# EAGLE design hs-32-spi-3d (EAGLE 9.6.2)
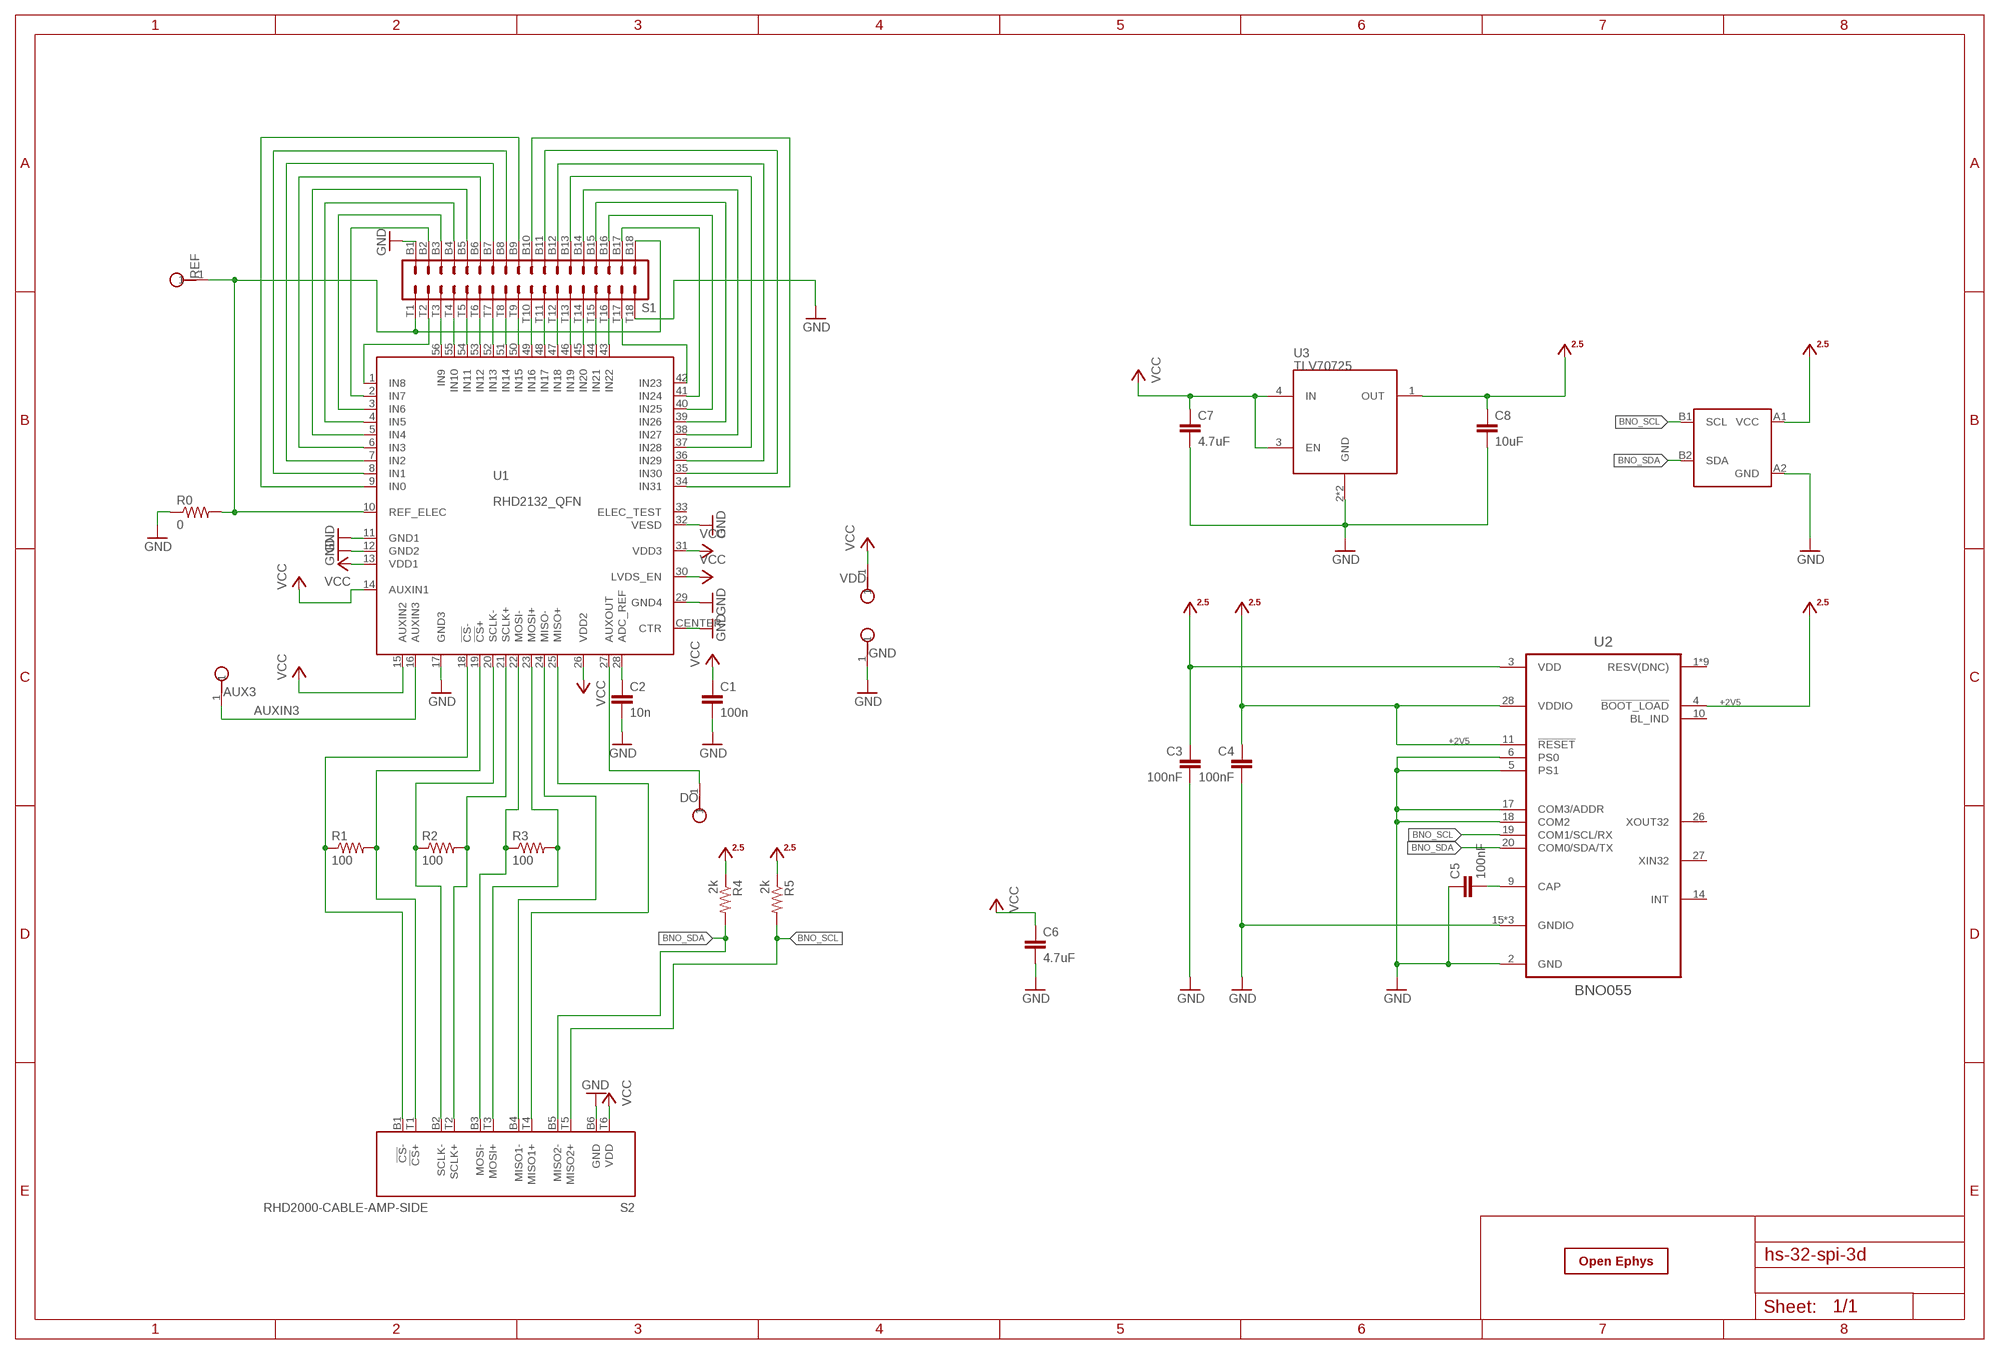
[diagram p0: schematic, sheet 1]

## Parts
AUX3  TESTPOINT_SMALL  [TESTPOINT_SMALL]
C1  100n  C_0402  [0402]
C2  10n  C_0402  [0402]
C3  100nF  C_0402T  [0402T]
C4  100nF  C_0402T  [0402T]
C5  100nF  C_0201T  [0201T]
C6  4.7uF  C_0402  [0402]
C7  4.7uF  C_0402T  [0402T]
C8  10uF  C_0402T  [0402T]
DO  TESTPOINT_SMALL  [TESTPOINT_SMALL]
GND  TESTPOINT_SMALL  [TESTPOINT_SMALL]
R0  0  R_0402  [0402]
R1  100  R_0402  [0402]
R2  100  R_0402  [0402]
R3  100  R_0402  [0402]
R4  2k  R_0201T  [0201T]
R5  2k  R_0201T  [0201T]
REF  TESTPOINT_SMALL  [TESTPOINT_SMALL]
S1  OMNETICS_A79025  [OMNETICS_A79025]
S2  RHD2000-CABLE-AMP-SIDE  [OMNETICS_PZN-12-AA]
U1  RHD2132_QFN  [QFN56_8_X_8_LARGE]
U2  BNO055  [LGA-28-3.8X5.2]
U3  TLV70725  TLV707  [X2SON]
U4  24CW640T-I/CS0668  [4-BALL_WAFFER_0.4MMX0.4MM]
VDD  TESTPOINT_SMALL  [TESTPOINT_SMALL]
X  OE-LOGO_3.5X2.5  [OE-LOGO-3.5X2.5]

## Nets
+2V5: C3.1 C4.1 C8.1 R4.1 R5.1 U2.3(VDD) U2.4(!BOOT_LOAD) U2.11(!RESET) U2.28(VDDIO) U3.1(OUT) U4.A1(VCC)
AUXIN3: AUX3.1 U1.16(AUXIN3)
BNO_SCL: R5.2 S2.T5(MISO2+) U2.19(COM1/SCL/RX) U4.B1(SCL)
BNO_SDA: R4.2 S2.B5(MISO2-) U2.20(COM0/SDA/TX) U4.B2(SDA)
GND: C1.2 C2.2 C3.2 C4.2 C5.1 C6.2 C7.2 C8.2 GND.1 R0.1 S1.B1 S1.T18 S2.B6(GND) U1.11(GND1) U1.12(GND2) U1.17(GND3) U1.29(GND4) U1.32(VESD) U1.CENTER(CTR) U2.2(GND) U2.5(PS1) U2.6(PS0) U2.15(GNDIO) U2.16(GNDIO) U2.17(COM3/ADDR) U2.18(COM2) U2.25(GNDIO) U3.2(GND) U3.PAD(GND) U4.A2(GND)
N$1: R0.2 REF.1 S1.B18 S1.T1 U1.10(REF_ELEC)
N$2: S1.B3 U1.3(IN6)
N$3: S1.B2 U1.2(IN7)
N$4: S1.B4 U1.4(IN5)
N$5: S1.B5 U1.5(IN4)
N$6: S1.B6 U1.6(IN3)
N$7: S1.B7 U1.7(IN2)
N$8: S1.B8 U1.8(IN1)
N$9: S1.B9 U1.9(IN0)
N$10: S1.B10 U1.34(IN31)
N$11: R1.1 S2.B1(!CS!-) U1.18(!CS!-)
N$12: S1.B17 U1.41(IN24)
N$13: S1.B16 U1.40(IN25)
N$14: S1.B15 U1.39(IN26)
N$15: S1.B14 U1.38(IN27)
N$16: S1.B13 U1.37(IN28)
N$17: S1.B12 U1.36(IN29)
N$18: S1.B11 U1.35(IN30)
N$19: S1.T9 U1.50(IN15)
N$20: S1.T8 U1.51(IN14)
N$21: S1.T7 U1.52(IN13)
N$22: S1.T3 U1.56(IN9)
N$23: S1.T4 U1.55(IN10)
N$24: S1.T5 U1.54(IN11)
N$25: S1.T6 U1.53(IN12)
N$26: S1.T10 U1.49(IN16)
N$27: S1.T11 U1.48(IN17)
N$28: S1.T12 U1.47(IN18)
N$29: S1.T13 U1.46(IN19)
N$30: S1.T14 U1.45(IN20)
N$31: S1.T15 U1.44(IN21)
N$32: S1.T16 U1.43(IN22)
N$33: S1.T2 U1.1(IN8)
N$34: S1.T17 U1.42(IN23)
N$35: R1.2 S2.T1(!CS!+) U1.19(!CS!+)
N$36: R2.1 S2.B2(SCLK-) U1.20(SCLK-)
N$37: R2.2 S2.T2(SCLK+) U1.21(SCLK+)
N$38: R3.1 S2.B3(MOSI-) U1.22(MOSI-)
N$39: R3.2 S2.T3(MOSI+) U1.23(MOSI+)
N$40: S2.B4(MISO1-) U1.24(MISO-)
N$41: S2.T4(MISO1+) U1.25(MISO+)
N$42: C2.1 U1.28(ADC_REF)
N$43: DO.1 U1.27(AUXOUT)
N$67: C5.2 U2.9(CAP)
VCC: C1.1 C6.1 C7.1 S2.T6(VDD) U1.13(VDD1) U1.14(AUXIN1) U1.15(AUXIN2) U1.26(VDD2) U1.30(LVDS_EN) U1.31(VDD3) U3.3(EN) U3.4(IN) VDD.1
Unconnected: U1.33(ELEC_TEST) U2.1(RESV(DNC)) U2.7(RESV(DNC)) U2.8(RESV(DNC)) U2.10(BL_IND) U2.12(RESV(DNC)) U2.13(RESV(DNC)) U2.14(INT) U2.21(RESV(DNC)) U2.22(RESV(DNC)) U2.23(RESV(DNC)) U2.24(RESV(DNC)) U2.26(XOUT32) U2.27(XIN32)

## Library data of the parts
AUX3 DO GND REF VDD = RHD2000_eval_board:TESTPOINT: PCB Test Point
C1 C2 = RHD2000_eval_board:C: Capacitor
C3-C6 = jonnew:C: Capacitor
C7 = jonnew:C: Capacitor; PARTNO: CL05A105KO5NNNC
C8 = jonnew:C: Capacitor; PARTNO: CL05A106MQ5NUNC
R0 R1-R3 = RHD2000_eval_board:R: Resistor
R4 R5 = jonnew:R: Resistor
S1 = RHD2000:OMNETICS_A79025
S2 = RHD2000:RHD2000-CABLE-AMP-SIDE
U1 = RHD2000:RHD2132
U2 = jonnew:BNO055
U3 = jonnew:TLV707
U4 = 24CW640T-I_CS0668:24CW640T-I/CS0668
X = jonnew:OE-LOGO

## Net classes
1 thick: width 1.016 mm
2 power: width 0.61 mm

## Board
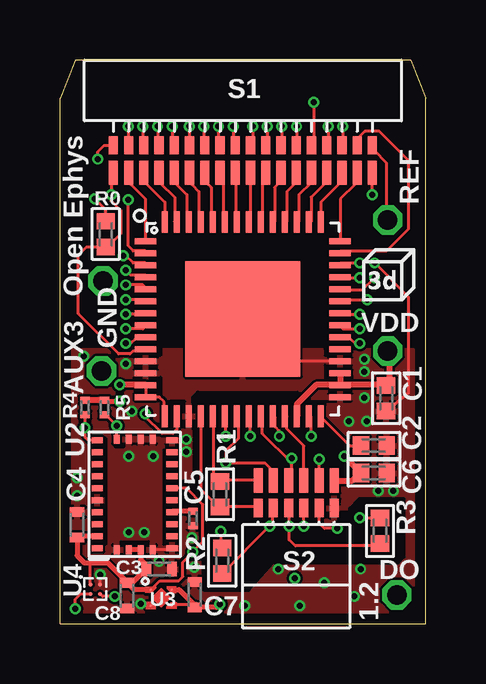
[diagram p1: board, top side]
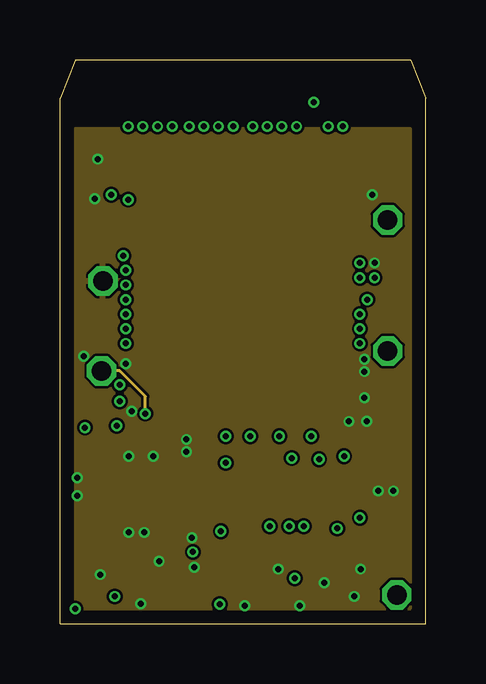
[diagram p2: board, inner layer Route2]
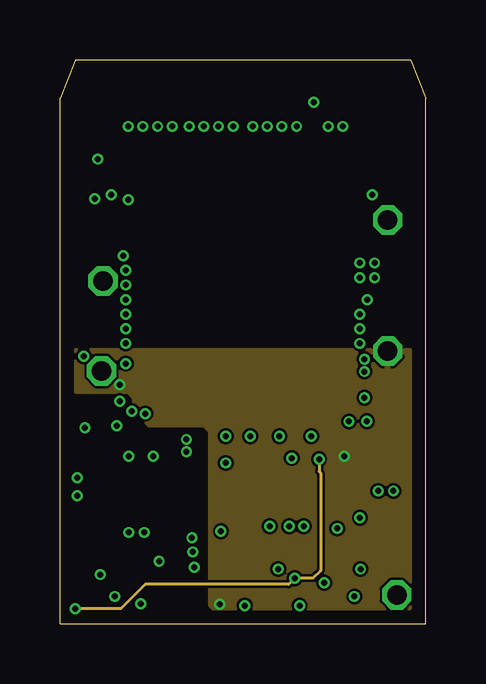
[diagram p3: board, inner layer Route3]
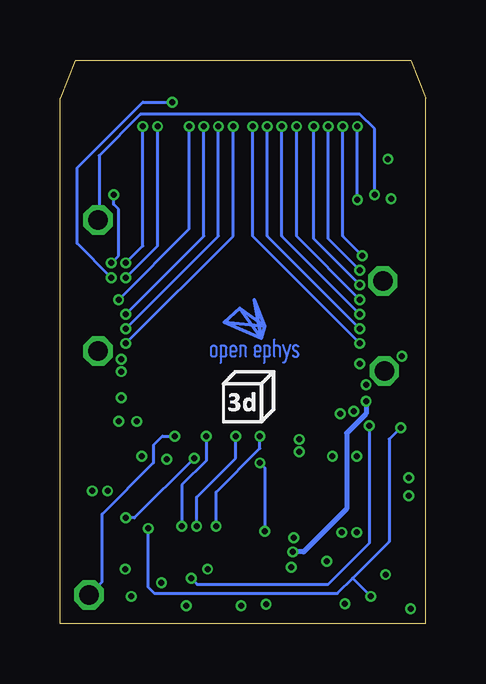
[diagram p4: board, bottom side, seen from below]

Size 15.24 x 23.5 mm. Coordinates in mm from the lower left corner, seen from the top.
Outline: 0,0 0,21.91 0.64,23.5 14.61,23.5 15.24,21.91 15.24,0 0,0
Copper layers (1*2+3*16): Top 0.035mm / dielectric 0.2mm / Route2 0.0175mm / dielectric 0.3mm / Route3 0.035mm / dielectric 0.2mm / Bottom 0.035mm
Design rules "seeed-studio-4-layer *": minimum track width 0.09mm, minimum drill 0.2mm, track to track 4mil, track to pad 4mil, pad to pad 4mil, via to via 4mil, smd to smd 0mil, copper to edge 0.1mm, drill to drill 10mil, minimum pad ring 6mil, minimum via ring 4mil, stop-mask expansion 1mil, vias tented up to drill 100mil, thermal gap 0.1mm
tRestrict: 26 lines

### Footprints (pad centres in the part's own frame; a part is rotated, then mirrored left to right if it is on the bottom)
TESTPOINT_SMALL = drill 0.813 octagon: 1 0,0
0402 = smd 0.686 x 0.762: 1 -0.533,0; 2 0.533,0
0402T = smd 0.4 x 0.6: 1 -0.533,0; 2 0.533,0
0201T = smd 0.3 x 0.4: 1 -0.3,0; 2 0.3,0
OMNETICS_A79025 = smd 0.381 x 0.762: B1 -5.397,-1.016; B2 -4.763,-1.016; B3 -4.128,-1.016; B4 -3.493,-1.016; B5 -2.857,-1.016; B6 -2.223,-1.016; B7 -1.587,-1.016; B8 -0.953,-1.016; B9 -0.318,-1.016; B10 0.318,-1.016; B11 0.953,-1.016; B12 1.587,-1.016; B13 2.223,-1.016; B14 2.857,-1.016; B15 3.493,-1.016; B16 4.128,-1.016; B17 4.763,-1.016; B18 5.397,-1.016 | smd 0.381 x 1.016: T1 -5.397,-2.159; T2 -4.763,-2.159; T3 -4.128,-2.159; T4 -3.493,-2.159; T5 -2.857,-2.159; T6 -2.223,-2.159; T7 -1.587,-2.159; T8 -0.953,-2.159; T9 -0.318,-2.159; T10 0.318,-2.159; T11 0.953,-2.159; T12 1.587,-2.159; T13 2.223,-2.159; T14 2.857,-2.159; T15 3.493,-2.159; T16 4.128,-2.159; T17 4.763,-2.159; T18 5.397,-2.159
OMNETICS_PZN-12-AA = smd 0.381 x 0.762: B1 1.587,-1.016; B2 0.953,-1.016; B3 0.318,-1.016; B4 -0.318,-1.016; B5 -0.953,-1.016; B6 -1.587,-1.016 | smd 0.381 x 1.016: T1 1.587,-2.159; T2 0.953,-2.159; T3 0.318,-2.159; T4 -0.318,-2.159; T5 -0.953,-2.159; T6 -1.587,-2.159
QFN56_8_X_8_LARGE = smd 0.9 x 0.25: 1 -4.05,3.25; 2 -4.05,2.75; 3 -4.05,2.25; 4 -4.05,1.75; 5 -4.05,1.25; 6 -4.05,0.75; 7 -4.05,0.25; 8 -4.05,-0.25; 9 -4.05,-0.75; 10 -4.05,-1.25; 11 -4.05,-1.75; 12 -4.05,-2.25; 13 -4.05,-2.75; 14 -4.05,-3.25; 29 4.05,-3.25; 30 4.05,-2.75; 31 4.05,-2.25; 32 4.05,-1.75; 33 4.05,-1.25; 34 4.05,-0.75; 35 4.05,-0.25; 36 4.05,0.25; 37 4.05,0.75; 38 4.05,1.25; 39 4.05,1.75; 40 4.05,2.25; 41 4.05,2.75; 42 4.05,3.25 | smd 0.25 x 0.9: 15 -3.25,-4.05; 16 -2.75,-4.05; 17 -2.25,-4.05; 18 -1.75,-4.05; 19 -1.25,-4.05; 20 -0.75,-4.05; 21 -0.25,-4.05; 22 0.25,-4.05; 23 0.75,-4.05; 24 1.25,-4.05; 25 1.75,-4.05; 26 2.25,-4.05; 27 2.75,-4.05; 28 3.25,-4.05; 43 3.25,4.05; 44 2.75,4.05; 45 2.25,4.05; 46 1.75,4.05; 47 1.25,4.05; 48 0.75,4.05; 49 0.25,4.05; 50 -0.25,4.05; 51 -0.75,4.05; 52 -1.25,4.05; 53 -1.75,4.05; 54 -2.25,4.05; 55 -2.75,4.05; 56 -3.25,4.05 | smd 4.8 x 4.8: CENTER 0,0
LGA-28-3.8X5.2 = smd 0.25 x 0.475: 1 -2.25,1.56; 6 -2.25,-1.56; 7 -1.75,-1.56; 8 -1.25,-1.56; 9 -0.75,-1.56; 10 -0.25,-1.56; 11 0.25,-1.56; 12 0.75,-1.56; 13 1.25,-1.56; 14 1.75,-1.56; 15 2.25,-1.56; 20 2.25,1.56; 21 1.75,1.56; 22 1.25,1.56; 23 0.75,1.56; 24 0.25,1.56; 25 -0.25,1.56; 26 -0.75,1.56; 27 -1.25,1.56; 28 -1.75,1.56 | smd 0.375 x 0.25: 2 -2.3,0.75; 3 -2.3,0.25; 4 -2.3,-0.25; 5 -2.3,-0.75; 16 2.3,-0.75; 17 2.3,-0.25; 18 2.3,0.25; 19 2.3,0.75
X2SON = smd 0.1 x 0.1: 1 -0.43,0.33; 2 -0.43,-0.33; 3 0.43,-0.33; 4 0.43,0.33 | smd 0.1 x 0.1 rotated 45: PAD 0,0
4-BALL_WAFFER_0.4MMX0.4MM = smd 0.163 x 0.163: A1 0,0; A2 0.4,0; B1 0,-0.4; B2 0.4,-0.4

### Placement (x,y rotation side)
AUX3  1.73,10.54 0 top
C1  13.59,9.4 270 top
C2  13.08,7.43 0 top
C3  4.13,2.29 0 top
C4  0.71,4.13 90 top
C5  5.54,4.39 90 top
C6  13.08,6.29 0 top
C7  5.61,1.22 90 top
C8  2.79,1.18 270 top
DO  14.03,1.21 0 top
GND  1.79,14.29 0 top
R0  1.91,16.24 270 top
R1  6.67,5.4 90 top
R2  6.76,2.63 90 top
R3  13.34,3.87 90 top
R4  1.04,9.02 270 top
R5  1.85,9.02 270 top
REF  13.65,16.83 90 top
S1  7.62,20.95 0 top
S2  9.84,3.81 180 top
U1  7.62,12.7 0 top
U2  3.11,5.4 90 top
U3  4.22,1.09 0 top
U4  1.27,1.65 0 top
VDD  13.65,11.37 0 top
X  7.3,11.81 0 bottom

### Tracks (layer width: path | path; a pad name or v marks a point on that pad's centre or on a via)
+2V5  (via drill 0.25)
  Top 0.127: U3.1 4.16,1.8 4.94,1.8 5.12,1.97 5.12,2.58 v5.54,3 5.95,3.41 5.95,4.97 5.28,5.65 U2.11 | R5.1 1.9,9.27 | U4.A1 1.27,2.54
  Top 0.203: U3.1 3.09,1.42 C8.1 | C8.1 3.01,1.71 C3.1 3.59,2.44 3.36,2.67 U2.4 U2.3 | C8.1 2.79,1.74 1.99,2.54 1.27,2.54 1.02,2.54 0.71,2.85 C4.1 0.77,3.65 U2.28 | 1.9,9.27 v2.49,9.27
  Top 0.254: R5.1 R4.1
  Bottom 0.203: v2.49,9.27 2.49,8.76 3.3,7.95 3.3,4.79 5.09,3 v5.54,3
AUXIN3  (via drill 0.25)
  Top 0.127: U1.16 4.87,8.11 4.7,7.94 4.25,7.94 3.56,8.64 v3.56,8.76
  Route2 0.127: v3.56,8.76 3.56,9.47 2.49,10.54 AUX3.1
BNO_SCL  (via drill 0.25)
  Top 0.127: U2.19 v2.36,8.26 | R5.2 1.91,8.72 v2.36,8.26 | v2.36,8.26 | S2.T5 v10.79,6.86 | v0.64,0.64 0.64,1.02 0.87,1.25 U4.B1
  Route3 0.127: v10.79,6.86 10.79,6.35 10.86,6.29 10.86,2.22 10.54,1.91 v9.78,1.91 9.53,1.65 3.56,1.65 2.54,0.64 v0.64,0.64
  Bottom 0.127: v2.36,8.26 2.36,3.35 4.06,1.65 9.53,1.65 v9.78,1.91
BNO_SDA  (via drill 0.25)
  Top 0.127: U2.20 1.2,7.65 1.04,7.8 v1.04,8.18 R4.2 | v11.56,3.98 11.01,3.98 10.79,4.19 S2.B5 | v2.29,1.14 1.78,1.14 U4.B2
  Bottom 0.127: v1.04,8.18 1.52,7.7 1.52,3.43 3.05,1.91 | 3.05,1.91 3.68,1.27 11.3,1.27 11.56,1.52 v11.56,3.98 | 3.05,1.91 v2.29,1.14
GND  (via drill 0.25)
  Top 0.127: U1.CENTER 9.35,10.97 11.58,10.97 U1.32 | v13.01,17.88 13.01,18.8 S1.T18 | v13.11,15.04 14.53,13.61 14.53,9.65 C1.2 | U2.6 4.62,3.1 U2.5 | v1.57,19.37 1.57,19.67 1.84,19.94 S1.B1 | R0.1 1.91,17.26 v1.45,17.72 | U4.A2 v1.67,2.05 v1.68,2.06
  Bottom 0.127: v13.01,17.88 13.01,17.48 12.8,17.27 12.8,15.34 v13.11,15.04
  other vias: 12.79,8.45 13.89,5.54 5.27,7.18 13.26,5.54 12.04,8.43 12.69,9.42 12.69,10.52 2.74,10.85 0.99,11.15 3.51,3.81 5.6,2.36 2.87,3.81 0.71,5.33 0.71,6.1 3.89,6.99 2.87,6.99 5.5,3.58 9.09,2.29 12.52,2.29 11.01,1.71 12.27,1.14 9.98,0.76 7.7,0.76 4.13,2.62 3.37,0.84 12.69,11.02 5.27,7.68 3,8.86
  pour Route2: 0.64,0.64 14.61,0.64 14.61,20.64 0.64,20.64
  pour Top: 0.76,0.51 14.73,0.51 14.73,11.43 0.51,11.43 0.51,0.51
N$1  (via drill 0.25)
  Top 0.127: S1.B18 13.11,19.91 13.11,19.71 13.61,19.2 13.61,16.87 REF.1 | S1.T1 2.13,18.8 v2.13,17.88 2.13,17.63 2.54,17.22 2.54,16.26 1.99,15.71 R0.2 1.78,15.71 1.65,15.71 1.1,15.71 0.76,15.37 0.76,12.93 2.44,11.25 2.92,11.25 3.05,11.38 3.56,11.38 U1.10
  Bottom 0.127: v2.13,17.88 2.13,20.62 2.74,21.23 11.89,21.23 13.61,19.51 13.61,16.87 REF.1
N$2  (via drill 0.25)
  Top 0.127: v3.45,20.73 3.45,20.02 S1.B3 | v2.64,15.34 2.74,15.34 3.05,15.04 3.56,15.04 U1.3
  Bottom 0.127: v3.45,20.73 3.45,16.15 v2.64,15.34
N$3  (via drill 0.25)
  Top 0.127: v2.85,20.73 2.85,20.02 S1.B2 | v2.85,17.68 2.85,15.75 3.05,15.54 3.56,15.54 U1.2
  Bottom 0.127: v2.85,17.68 v2.85,20.73
N$4  (via drill 0.25)
  Top 0.127: v4.06,20.73 4.06,20.02 S1.B4 | v2.74,14.73 2.95,14.53 3.56,14.53 U1.4
  Bottom 0.127: v4.06,20.73 4.06,16.05 v2.74,14.73
N$5  (via drill 0.25)
  Top 0.127: v4.67,20.73 4.67,20.02 S1.B5 | v2.74,14.12 3.45,14.12 3.56,14.02 U1.5
  Bottom 0.127: v4.67,20.73 4.67,16.05 v2.74,14.12
N$6  (via drill 0.25)
  Top 0.127: v5.38,20.73 5.38,20.02 S1.B6 | v2.74,13.51 3.56,13.51 U1.6
  Bottom 0.127: v5.38,20.73 5.38,16.15 v2.74,13.51
N$7  (via drill 0.25)
  Top 0.127: v5.99,20.73 5.99,20.02 S1.B7 | v2.74,12.9 3.56,12.9 U1.7
  Bottom 0.127: v5.99,20.73 5.99,16.15 v2.74,12.9
N$8  (via drill 0.25)
  Top 0.127: v6.6,20.73 6.6,20.02 S1.B8 | v2.74,12.29 3.45,12.29 3.56,12.39 U1.8
  Bottom 0.127: v6.6,20.73 6.6,16.15 v2.74,12.29
N$9  (via drill 0.25)
  Top 0.127: v7.21,20.73 7.21,20.02 S1.B9 | v2.74,11.68 2.95,11.68 3.15,11.89 3.56,11.89 U1.9
  Bottom 0.127: v7.21,20.73 7.21,16.15 v2.74,11.68
N$10  (via drill 0.25)
  Top 0.127: v8.03,20.73 8.03,20.02 S1.B10 | v12.5,11.68 12.29,11.68 12.09,11.89 11.68,11.89 U1.34
  Bottom 0.127: v8.03,20.73 8.03,16.15 v12.5,11.68
N$11
  Top 0.127: S2.B1 8.23,4.88 6.71,4.88 R1.1 6.6,4.88 5.89,5.59 5.89,8.64 U1.18
N$12
  Top 0.127: S1.B17 12.39,20.02 12.39,20.22 12.7,20.52 13.31,20.52 14.53,19.3 14.53,16.46 13.61,15.54 11.68,15.54 U1.41
N$13  (via drill 0.25)
  Top 0.127: v11.79,20.73 11.79,20.02 S1.B16 | v12.5,15.04 11.68,15.04 U1.40
  Bottom 0.127: v11.79,20.73 11.79,15.75 v12.5,15.04
N$14  (via drill 0.25)
  Top 0.127: v11.18,20.73 11.18,20.02 S1.B15 | v12.5,14.43 11.68,14.43 U1.39
  Bottom 0.127: v11.18,20.73 11.18,15.75 v12.5,14.43
N$15  (via drill 0.25)
  Top 0.127: v10.57,21.74 10.57,20.02 S1.B14 | v13.11,14.43 12.6,13.92 11.68,13.92 U1.38
  Bottom 0.127: v10.57,21.74 11.79,21.74 14.53,19 14.53,15.85 v13.11,14.43
N$16  (via drill 0.25)
  Top 0.127: v9.86,20.73 9.86,20.02 S1.B13 | v12.8,13.51 11.68,13.51 U1.37
  Bottom 0.127: v9.86,20.73 9.86,16.46 v12.8,13.51
N$17  (via drill 0.25)
  Top 0.127: v9.25,20.73 9.25,20.02 S1.B12 | v12.5,12.9 11.68,12.9 U1.36
  Bottom 0.127: v9.25,20.73 9.25,16.15 v12.5,12.9
N$18  (via drill 0.25)
  Top 0.127: v8.64,20.73 8.64,20.02 S1.B11 | v12.5,12.29 11.79,12.29 11.68,12.39 U1.35
  Bottom 0.127: v8.64,20.73 8.64,16.15 v12.5,12.29
N$19
  Top 0.127: U1.50 7.32,16.76 7.32,18.8 S1.T9
N$20
  Top 0.127: U1.51 6.81,16.76 6.81,18.69 6.71,18.8 S1.T8
N$21
  Top 0.127: U1.52 6.3,16.76 6.3,18.19 6.1,18.39 6.1,18.8 S1.T7
N$22
  Top 0.127: U1.56 4.37,16.76 4.37,17.58 3.56,18.39 3.56,18.8 S1.T3
N$23
  Top 0.127: U1.55 4.78,16.76 4.78,17.78 4.17,18.39 4.17,18.8 S1.T4
N$24
  Top 0.127: U1.54 5.28,16.76 5.28,17.88 4.78,18.39 4.78,18.8 S1.T5
N$25
  Top 0.127: U1.53 5.79,16.76 5.79,18.01 5.49,18.31 5.49,18.8 S1.T6
N$26
  Top 0.127: U1.49 7.92,16.76 7.92,18.8 S1.T10
N$27
  Top 0.127: U1.48 8.43,16.76 8.43,18.69 8.53,18.8 S1.T11
N$28
  Top 0.127: U1.47 8.94,16.76 8.94,18.19 9.14,18.39 9.14,18.8 S1.T12
N$29
  Top 0.127: U1.46 9.45,16.76 9.45,18.01 9.75,18.31 9.75,18.8 S1.T13
N$30
  Top 0.127: U1.45 9.96,16.76 9.96,17.88 10.46,18.39 10.46,18.8 S1.T14
N$31
  Top 0.127: U1.44 10.46,16.76 10.46,17.78 11.07,18.39 11.07,18.8 S1.T15
N$32
  Top 0.127: U1.43 10.87,16.76 10.87,17.58 11.68,18.39 11.68,18.8 S1.T16
N$33
  Top 0.127: U1.1 3.56,15.95 3.56,17.7 2.95,18.31 2.95,18.8 S1.T2
N$34
  Top 0.127: U1.42 11.68,15.95 11.68,17.7 12.29,18.31 12.29,18.8 S1.T17
N$35
  Top 0.127: S2.T1 8.23,5.99 6.71,5.99 R1.2 6.4,6.2 6.4,8.64 U1.19
N$36  (via drill 0.25)
  Top 0.127: R2.1 8.72,4.06 v8.74,4.06 8.84,4.17 8.84,4.78 S2.B2 | v6.91,7.82 6.91,8.64 U1.20
  Bottom 0.127: v6.91,7.82 6.91,7.32 8.74,5.49 v8.74,4.06
N$37  (via drill 0.25)
  Top 0.127: v6.71,3.86 6.71,3.26 R2.2 | U1.21 7.42,8.64 7.42,7.72 6.91,7.21 v6.91,6.71 8.53,6.71 8.84,6.4 8.84,5.99 S2.T2
  Bottom 0.127: v6.71,3.86 6.71,6.5 v6.91,6.71
N$38  (via drill 0.25)
  Top 0.127: R3.1 13.25,3.25 9.8,3.25 9.55,3.5 v9.55,4.06 9.55,4.78 S2.B3 | v7.92,7.82 7.92,8.64 U1.22
  Bottom 0.127: v7.92,7.82 7.92,6.91 9.55,5.28 v9.55,4.06
N$39  (via drill 0.25)
  Top 0.127: v12.5,4.42 13.31,4.42 R3.2 | 9.65,6.71 9.65,6.1 S2.T3 | 9.65,6.71 8.43,7.92 8.43,8.64 U1.23 | 9.65,6.71 v9.65,6.91
  Bottom 0.127: v12.5,4.42 12.14,4.42 v9.65,6.91
N$40  (via drill 0.25)
  Top 0.127: v10.16,4.06 S2.B4 | v9.14,7.82 9.14,8.03 8.94,8.23 8.94,8.64 U1.24
  Bottom 0.127: v10.16,4.06 10.16,5.79 9.14,6.81 v9.14,7.82
N$41
  Top 0.127: S2.T4 10.16,7.42 9.45,8.13 9.45,8.64 U1.25
N$42
  Top 0.127: C2.1 12.08,7.43 10.87,8.64 U1.28
N$43  (via drill 0.25)
  Top 0.127: v10.46,7.82 10.46,8.64 U1.27
  Bottom 0.127: v10.46,7.82 10.97,7.82 11.35,7.44 11.35,6.71 13.49,4.57 13.49,1.75 DO.1
N$67
  Top 0.203: C5.2 4.72,4.69 U2.9
VCC  (via drill 0.25)
  Top 0.127: U1.13 U1.14 4.14,9.45 4.34,9.25 4.34,8.68 U1.15 | U1.30 11.68,9.96 | 9.88,8.66 U1.26 | 11.68,10.36 U1.31 | 13.72,9.98 C1.1 | 5.47,0.79 4.67,0.79
  Top 0.203: VDD.1 13.72,11.3 | C1.1 13.56,9.96 | 12.5,6.29 C6.1 | v11.85,6.99 v11.84,6.99 | v6.66,0.81 6.53,0.69 C7.1 5.71,0.79 5.6,0.79 | 5.6,0.79 5.47,0.79 | 4.67,0.79 U3.3 | U3.4 4.97,1.42 5.6,0.79
  Top 0.254: U1.13 v2.49,9.96 | 9.88,8.66 9.88,9.17 10.67,9.96 U1.30 | 11.68,10.36 11.68,9.96 13.56,9.96 | 13.72,11.3 13.72,9.98 | S2.T6 12.18,5.97 12.5,6.29 | C6.1 v11.85,6.99
  pour Route3: 0.64,9.65 2.79,9.65 3.05,9.4 3.05,8.89 3.68,8.26 5.97,8.26 6.22,8 6.22,0.76 6.35,0.64 14.61,0.64 14.61,11.43 0.64,11.43

### Text on the board
tPlace: Open Ephys | 1.2